# EAGLE schematic 48x_49x Breakout Board RevA (EAGLE 8.3.1)
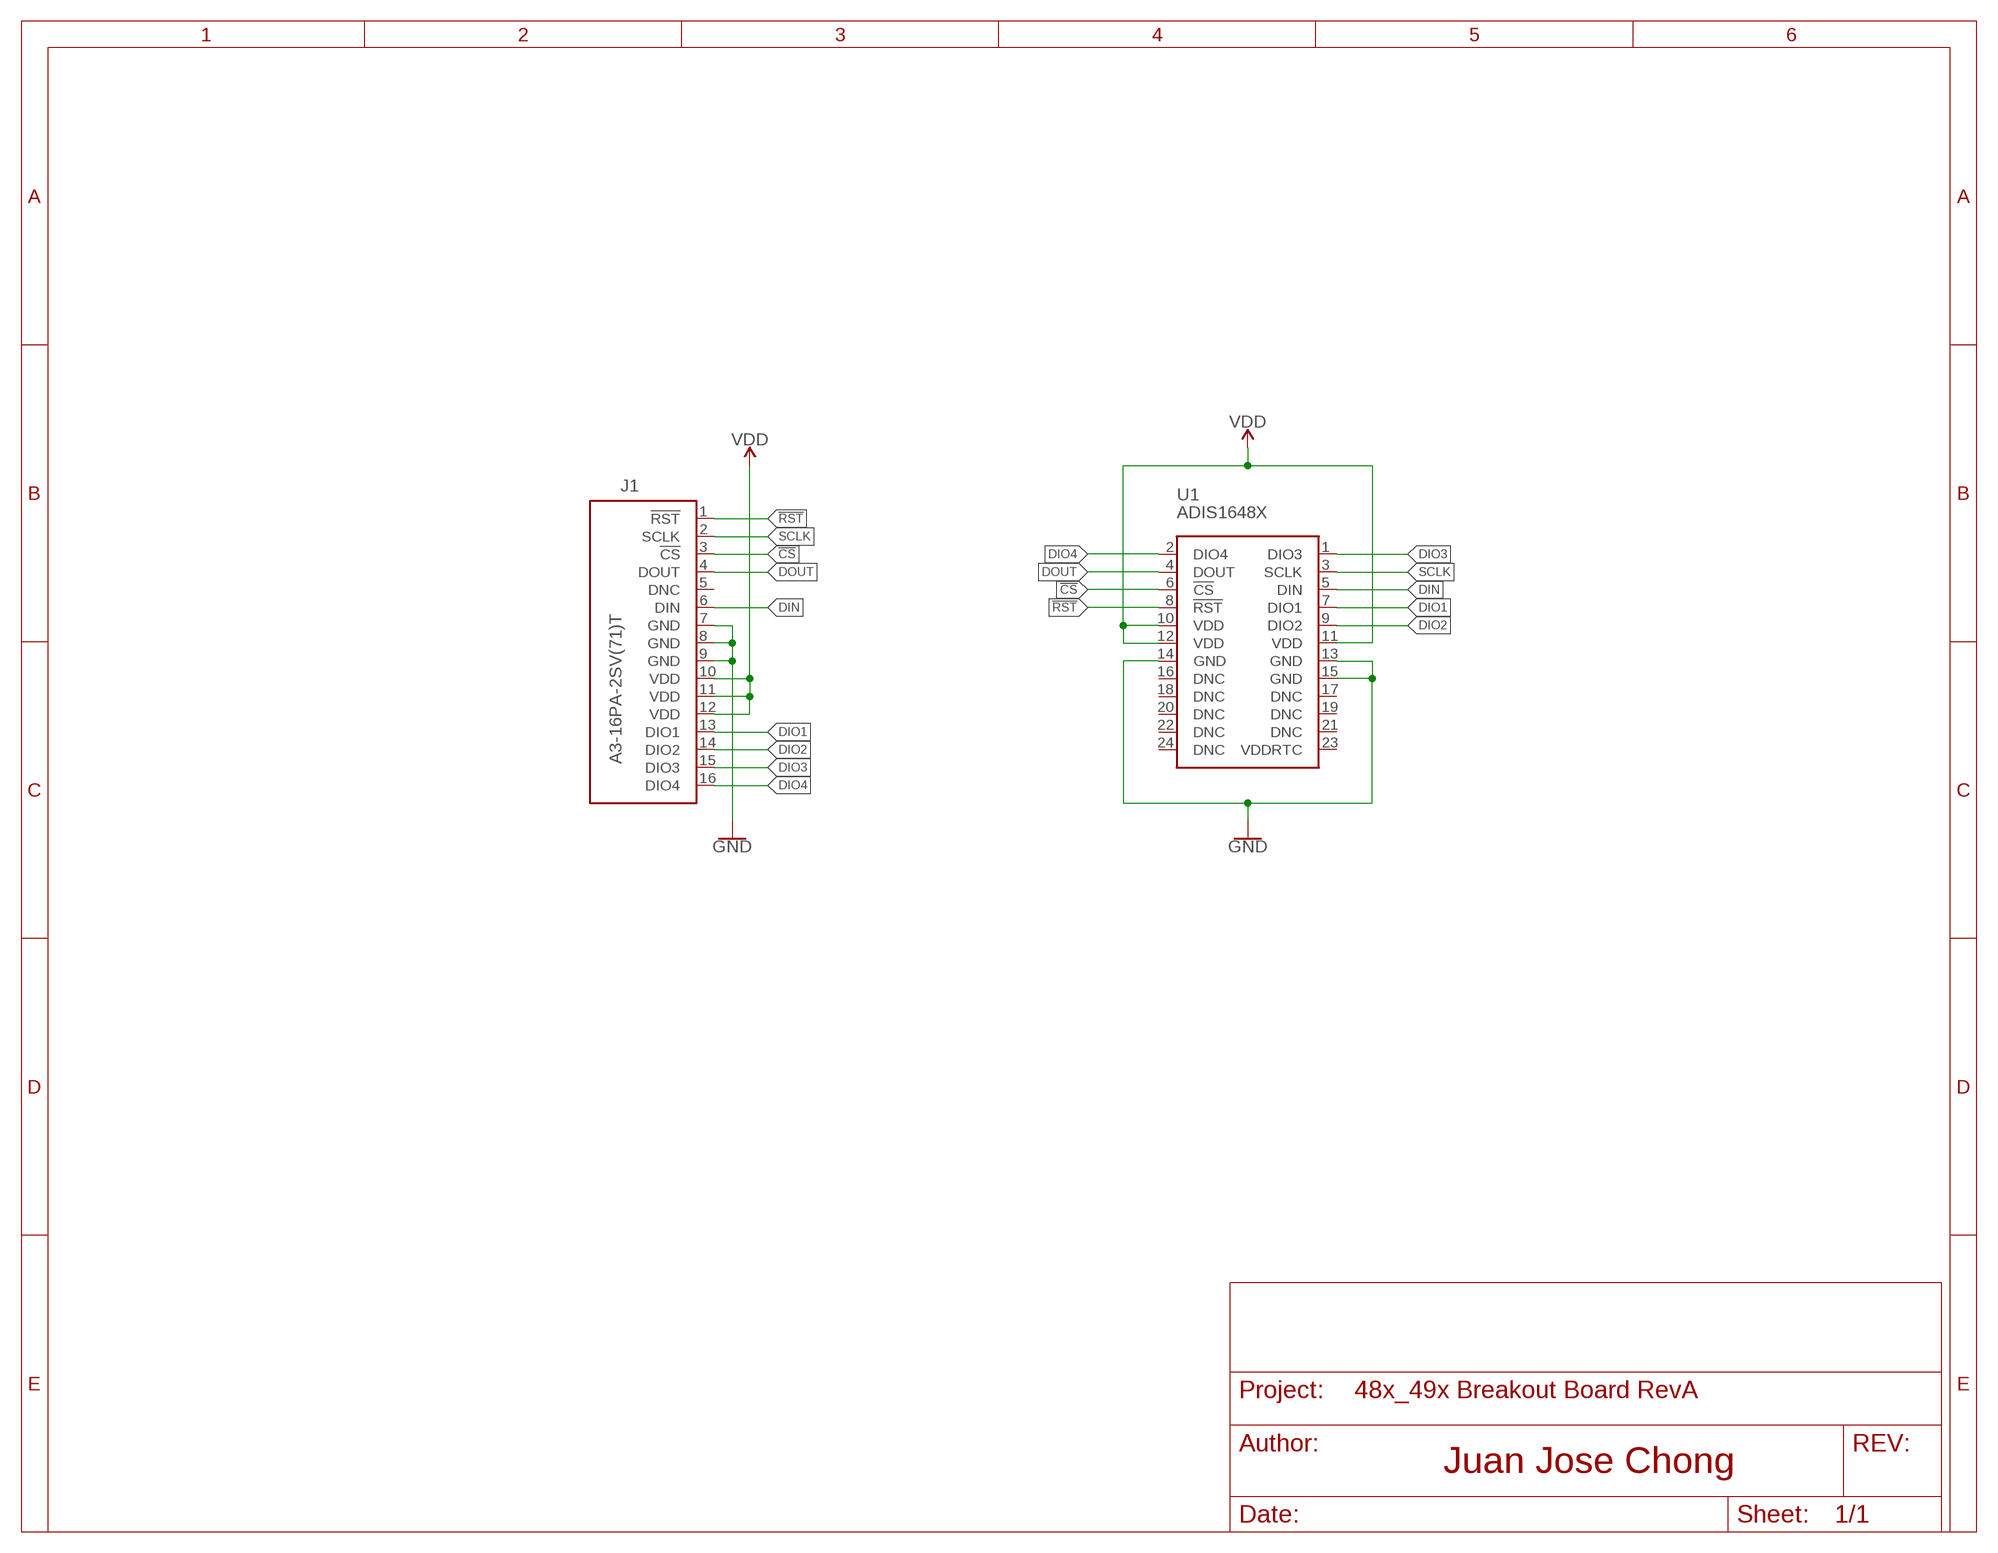
[diagram p0: schematic, sheet 1]

## Parts
J1  A3-16PA-2SV(71)T  [A3-16PA-2SV(71)-TOP]
U1  ADIS1648X  [ADIS1648X]

## Nets
!CS: J1.3(!CS) U1.6(!CS)
!RST: J1.1(!RST) U1.8(!RST)
DIN: J1.6(DIN) U1.5(DIN)
DIO1: J1.13(DIO1) U1.7(DIO1)
DIO2: J1.14(DIO2) U1.9(DIO2)
DIO3: J1.15(DIO3) U1.1(DIO3)
DIO4: J1.16(DIO4) U1.2(DIO4)
DOUT: J1.4(DOUT) U1.4(DOUT)
GND: J1.7(GND) J1.8(GND) J1.9(GND) U1.13(GND) U1.14(GND) U1.15(GND)
SCLK: J1.2(SCLK) U1.3(SCLK)
VDD: J1.10(VDD) J1.11(VDD) J1.12(VDD) U1.10(VDD) U1.11(VDD) U1.12(VDD)
Unconnected: J1.5(DNC) U1.16(DNC) U1.17(DNC) U1.18(DNC) U1.19(DNC) U1.20(DNC) U1.21(DNC) U1.22(DNC) U1.23(VDDRTC) U1.24(DNC)

## Library data of the parts
J1 = Analog Devices iSensors:A3-16PA-2SV(71)
U1 = Analog Devices iSensors:ADIS1648X